# Altium project PCB_Project1.PrjPCB
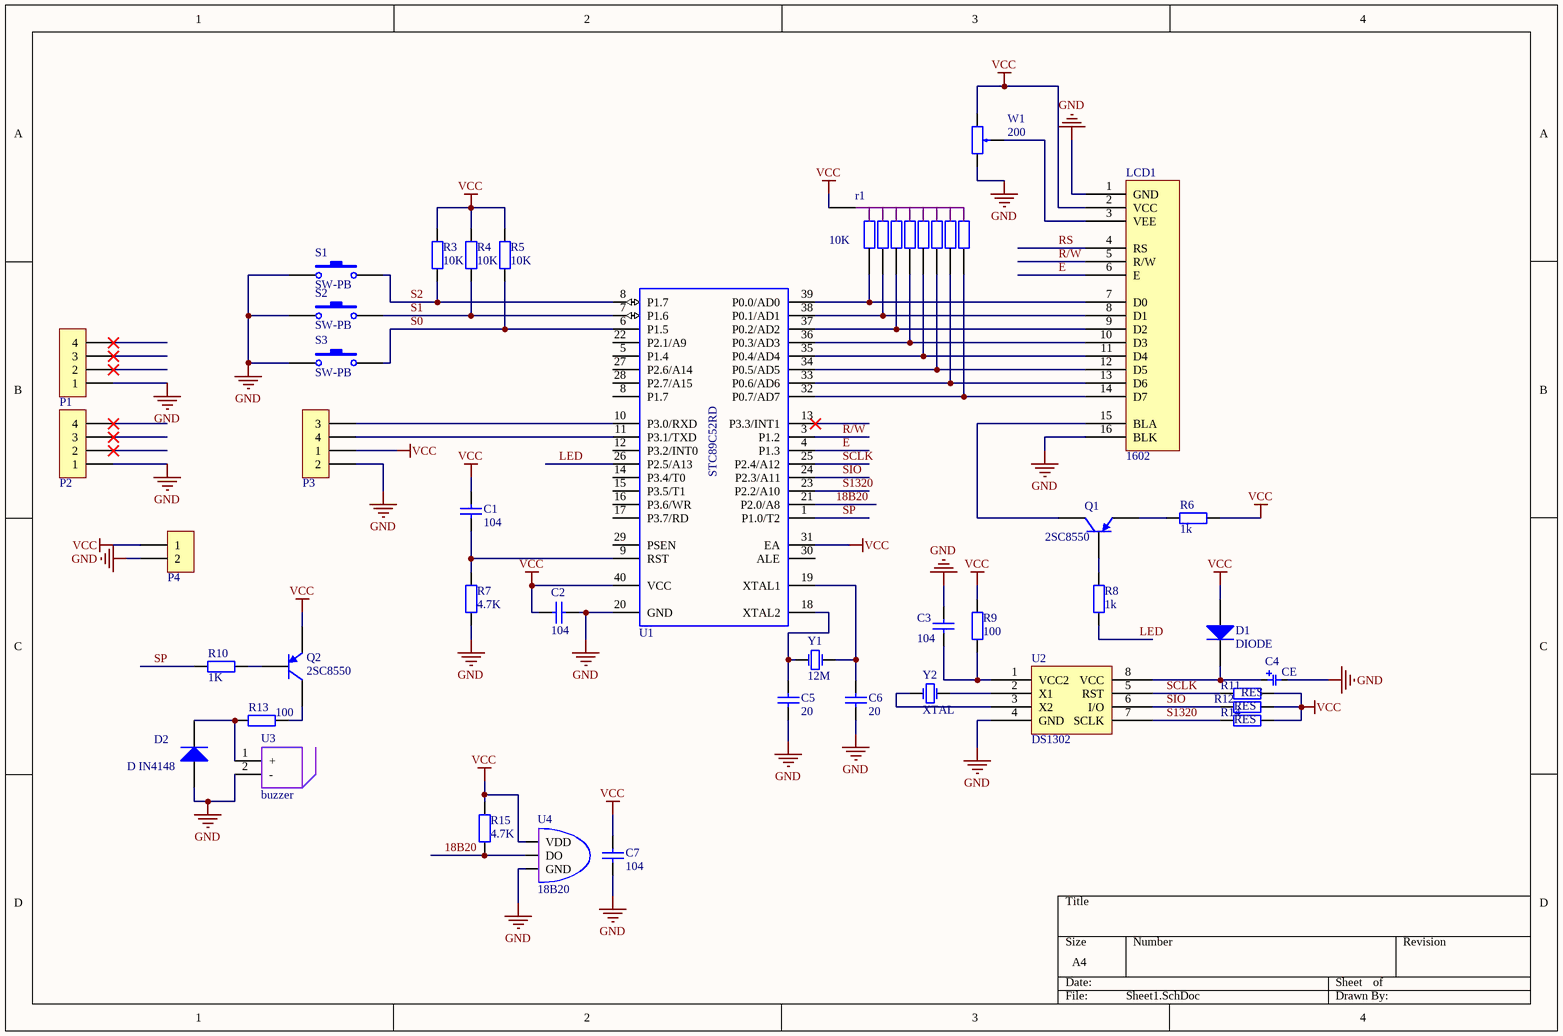
[diagram p0: Sheet1.SchDoc]
1 sheet, 40 parts. Net scope: global (net labels, ports and power ports of the same name join across sheets).
Board file: PCB1.PcbDoc

## Sheet Sheet1.SchDoc
size A4

### Parts
C1  104  [0805C]
C2  104  [0805C]
C3  104  [0805C]
C4  CE  [2817c+]
C5  20  [0805C]
C6  20  [0805C]
C7  104  [0805C]
D1  DIODE  [SS14-4007]
D2  D IN4148  [4148YZ]
LCD1  1602  [LCD1602]
P1  CON4  [sip4]  (value not drawn)
P2  CON4  [sip4]  (value not drawn)
P3  CON4  [sip4]  (value not drawn)
P4  CON2  [SIP2]  (value not drawn)
Q1  2SC8550  [SOT23]
Q2  2SC8550  [SOT23]
r1  10K  [RPZ9]
R3  10K  [0805R]
R4  10K  [0805R]
R5  10K  [0805R]
R6  1k  [0805R]
R7  4.7K  [0805R]
R8  1k  [0805R]
R9  100  [0805R]
R10  1K  [0805R]
R11  RES  [0805R]
R12  RES  [0805R]
R13  100  [0805R]
R14  RES  [0805R]
R15  4.7K  [0805R]
S1  SW-PB  [SW-AJ24]
S2  SW-PB  [SW-AJ24]
S3  SW-PB  [SW-AJ24]
U1  STC89C52  [DIP40]  (value not drawn)
U2  DS1302  [DIP8]
U3  buzzer  [BUZZER]
U4  18B20  [18b20]
W1  200  [RV]
Y1  12M  [XTAL]
Y2  XTAL  [xtal1-X]

### Nets
GND: C2.2 C3.2 C4.2 C5.1 C6.1 C7.1 D2.1(A) LCD1.1(GND) LCD1.16(BLK) P1.1 P2.1 P3.2 P4.2 R7.1 S1.1 S2.1 S3.1 U1.20(GND) U2.4(GND) U3.2(-) U4.1(GND) W1.3
VCC: C1.2 C2.1 C7.2 D1.1(A) LCD1.2(VCC) P3.1 P4.1 Q2.E r1.1 R3.2 R4.2 R5.2 R6.1 R9.2 R11.2 R12.2 R14.2 R15.2 U1.31(EA) U1.40(VCC) U4.3(VDD) W1.1
18B20: R15.1 U1.21(P2.0/A8) U4.2(DO)
E: LCD1.6(E) U1.4(P1.3)
LED: R8.1 U1.26(P2.5/A13)
R/W: LCD1.5(R/W) U1.3(P1.2)
RS: LCD1.4(RS)
S0: R5.1 S3.2 U1.6(P1.5)
S1: R4.1 S2.2 U1.7(P1.6)
S2: R3.1 S1.2 U1.8(P1.7)
S1320: R14.1 U1.23(P2.2/A10) U2.7(SCLK)
SCLK: R11.1 U1.25(P2.4/A12) U2.5(RST)
SIO: R12.1 U1.24(P2.3/A11) U2.6(I/O)
SP: R10.1 U1.1(P1.0/T2)
NetC1_1: C1.1 R7.2 U1.9(RST)
NetC3_1: C3.1 R9.1 U2.1(VCC2)
NetC4_1: C4.1 D1.2(K) U2.8(VCC)
NetC5_2: C5.2 U1.18(XTAL2) Y1.2
NetC6_2: C6.2 U1.19(XTAL1) Y1.1
NetD2_2: D2.2(K) R13.2 U3.1(+)
NetLCD1_3: LCD1.3(VEE) W1.W
NetLCD1_7: LCD1.7(D0) r1.2 U1.39(P0.0/AD0)
NetLCD1_8: LCD1.8(D1) r1.3 U1.38(P0.1/AD1)
NetLCD1_9: LCD1.9(D2) r1.4 U1.37(P0.2/AD2)
NetLCD1_10: LCD1.10(D3) r1.5 U1.36(P0.3/AD3)
NetLCD1_11: LCD1.11(D4) r1.6 U1.35(P0.4/AD4)
NetLCD1_12: LCD1.12(D5) r1.7 U1.34(P0.5/AD5)
NetLCD1_13: LCD1.13(D6) r1.8 U1.33(P0.6/AD6)
NetLCD1_14: LCD1.14(D7) r1.9 U1.32(P0.7/AD7)
NetLCD1_15: LCD1.15(BLA) Q1.C
NetP3_3: P3.3 U1.10(P3.0/RXD)
NetP3_4: P3.4 U1.11(P3.1/TXD)
NetQ1_B: Q1.B R8.2
NetQ1_E: Q1.E R6.2
NetQ2_B: Q2.B R10.2
NetQ2_C: Q2.C R13.1
NetU2_2: U2.2(X1) Y2.2
NetU2_3: U2.3(X2) Y2.1

Not connected (* = marked no-connect by the designer): P1 2* 3* 4*; P2 2* 3* 4*; U1 5(P1.4) 12(P3.2/INT0) 13(P3.3/INT1)* 14(P3.4/T0) 15(P3.5/T1) 16(P3.6/WR) 17(P3.7/RD) 22(P2.1/A9) 27(P2.6/A14) 28(P2.7/A15) 29(PSEN) 30(ALE)

### Notes on the sheet
- (in symbol STC89C52) STC89C52RD

### Library data of the parts
C1-C3 C5-C7 = CAP
r1 = RPZ9
R3-R10 R13 R15 = RES
S1-S3 = SW-PB: Switch; Published: 24-Mar-1999; LatestRevisionDate: 17-Jul-2002; LatestRevisionNote: Re-released for DXP Platform.; PackageReference: SPST-2; Publisher: Altium Limited; PackageDescription: Switch; 2 Leads
W1 = RV: Variable Resistor; Set Position: 0.5; Published: 8-Jun-2000; LatestRevisionDate: 17-Jul-2002; LatestRevisionNote: Re-released for DXP Platform.; PackageReference: AXIAL-0.6; Publisher: Altium Limited; PackageDescription: Axial Device, Thru-Hole; 2 Leads; 0.6 in Pin Spacing
Y1 Y2 = XTAL: Crystal Oscillator; Published: 8-Jun-2000; LatestRevisionDate: 17-Jul-2002; LatestRevisionNote: Re-released for DXP Platform.; PackageReference: R38; Publisher: Altium Limited; PackageDescription: Crystal, Thru-Hole; 2 Leads; Body 3.1 x 8.2 mm (Dia.xH)